# Altium project EL.T01.MSHM.PrjPcb
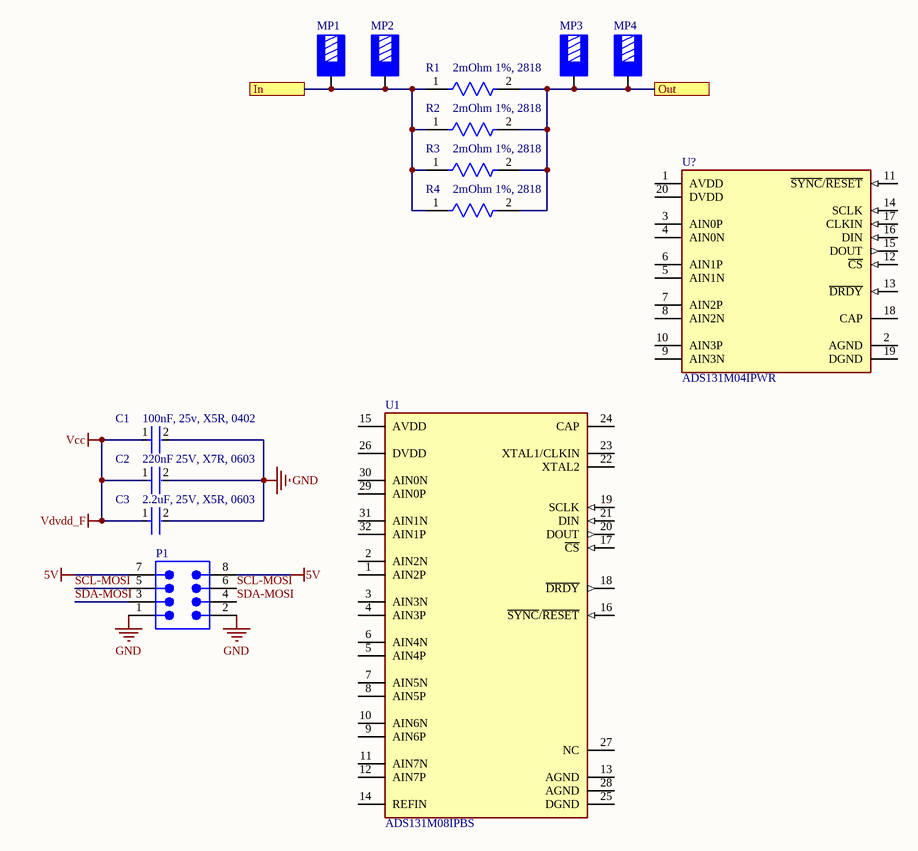
[diagram p0: MainShunt.SchDoc]
1 sheet, 14 parts. Net scope: flat (ports and power ports of the same name join across sheets).
Board file: MainShunt.PcbDoc

## Sheet MainShunt.SchDoc
size A4; SheetNumber: 1; SheetTotal: 1

### Parts
C1  100nF, 25v, X5R, 0402  [FP-GRM155-0_05-IPC_C]
C2  220nF 25V, X7R, 0603  [FP-GCM188-0_1-IPC_B]
C3  2.2uF, 25V, X5R, 0603  [FP-GRM188-0_1-e0_2_0_5-MFG]
MP1  7460307  [7460307_chemical surface]  (value not drawn)
MP2  7460307  [7460307_chemical surface]  (value not drawn)
MP3  7460307  [7460307_chemical surface]  (value not drawn)
MP4  7460307  [7460307_chemical surface]  (value not drawn)
P1  61200821621  [61200821621]  (value not drawn)
R1  2mOhm 1%, 2818  [FP-WSHP2818-MFG]
R2  2mOhm 1%, 2818  [FP-WSHP2818-MFG]
R3  2mOhm 1%, 2818  [FP-WSHP2818-MFG]
R4  2mOhm 1%, 2818  [FP-WSHP2818-MFG]
U1  ADS131M08IPBS  [FP-PBS0032A-IPC_C]
U?  ADS131M04IPWR  [FP-PW0020A-IPC_A]

### Ports
In, Out

### Nets
5V: P1.7 P1.8
GND: C1.2 C2.2 C3.2 P1.1 P1.2
Vcc: C1.1 C2.1 C3.1  [also labelled Vdvdd_F]
SCL-MOSI: P1.5 P1.6
SDA-MOSI: P1.3 P1.4
NetMP1_1: MP1.1 MP2.1 R1.1 R2.1 R3.1 R4.1 ; port In
NetMP3_1: MP3.1 MP4.1 R1.2 R2.2 R3.2 R4.2 ; port Out

Not connected (* = marked no-connect by the designer): U1 1(AIN2P) 2(AIN2N) 3(AIN3N) 4(AIN3P) 5(AIN4P) 6(AIN4N) 7(AIN5N) 8(AIN5P) 9(AIN6P) 10(AIN6N) 11(AIN7N) 12(AIN7P) 13(AGND) 14(REFIN) 15(AVDD) 16(~{SYNC}/~{RESET}) 17(~{CS}) 18(~{DRDY}) 19(SCLK) 20(DOUT) 21(DIN) 22(XTAL2) 23(XTAL1/CLKIN) 24(CAP) 25(DGND) 26(DVDD) 27(NC) 28(AGND) 29(AIN0P) 30(AIN0N) 31(AIN1N) 32(AIN1P); U? 1(AVDD) 2(AGND) 3(AIN0P) 4(AIN0N) 5(AIN1N) 6(AIN1P) 7(AIN2P) 8(AIN2N) 9(AIN3N) 10(AIN3P) 11(~{SYNC}/~{RESET}) 12(~{CS}) 13(~{DRDY}) 14(SCLK) 15(DOUT) 16(DIN) 17(CLKIN) 18(CAP) 19(DGND) 20(DVDD)

### Library data of the parts
C1 = CMP-06035-003661-1: Chip Multilayer Ceramic Capacitors for General Purpose, 0402, 0.10uF, X7R, 15%, 10%, 25V; Length: 1mm; Depth: 0.5mm; Dielectric: X7R; Voltage Rating: 25V; Lead Free: Lead Free; Case Code (Imperial): 0402; Voltage: 25V; Min Operating Temperature: -55°C; Tolerance: 10%; Dielectric Material: Ceramic; Voltage Rating (DC): 25V; Max Operating Temperature: 125°C; Capacitance: 100nF; Thickness: 0.022inch; Case/Package: 0402; Height: 0.5mm; Resistor Type: Ceramic; Weight: 0.000212oz; Case Code (Metric): 1005; Package Quantity: 10000; Termination: SMD/SMT; Width: 0.02inch; Mount: Surface Mount; Packaging: Tape and Reel
C2 = CMP-2006-02366-2: Ceramic Capacitor for Automotive 220nF  ±10% 25VDC X7R 0603 Paper T/R; Capacitance: 220nF; Mount: Surface Mount; Ratings: AEC-Q200; Case/Package: 0603; Packaging: Tape and Reel; Radiation Hardening: No; Voltage: 25V; Dielectric: X7R; Case Code (Imperial): 0603; Max Operating Temperature: 125°C; Min Operating Temperature: -55°C; Depth: 0.8mm; Termination: SMD/SMT; Package Quantity: 1; Case Code (Metric): 1608; Thickness: 0.035inch; Voltage Rating: 25V; Tolerance: 10%; Voltage Rating (DC): 25V; Height: 0.8mm; Lead Free: Lead Free; Length: 1.6mm; Width: 0.031inch
C3 = CMP-2006-02820-2: Chip Multilayer Ceramic Capacitors for General Purpose, 0603, 2.2uF, X5R, 15%, 10%, 25V; Number of Pins: 2; Dielectric: X5R; Tolerance: 10%; Case Code (Imperial): 0603; Thickness: 0.035inch; Case/Package: 0603; Lead Free: Lead Free; Mount: Surface Mount; Material: Ceramic; Depth: 0.8mm; Voltage: 25V; Capacitance: 2.2uF; Min Operating Temperature: -55°C; Package Quantity: 4000; REACH SVHC: No SVHC; Resistor Type: Ceramic; Packaging: Tape and Reel; Case Code (Metric): 1608; Max Operating Temperature: 85°C; Width: 0.8mm; Termination: SMD/SMT; Voltage Rating: 25V; Length: 1.6mm; Voltage Rating (DC): 25V; Height: 0.8mm; Radiation Hardening: No; Weight: 0.000222oz
MP1-MP4 = CMP-03913-18187384-1: 7460307 8 Pin Power Element, Copper Zinc Alloy, 160A, M4, Vertical; Number of Contacts: 8; Insulation: Non-Insulated; Width: 9mm; Min Operating Temperature: -55°C; Number of Pins: 8; Contact Material: Copper; RoHS: Compliant; Packaging: Bulk; Thread Size: M4; Termination: Press-Fit; Mount: Through Hole; Material: Brass; Height: 10.5mm; Length: 9mm; Max Operating Temperature: 150°C; Number of Rows: 2; Contact Plating: Tin; NexarPartId: 18187384; Current Rating: 160A; REACH SVHC: Unknown
P1 = CMP-1502-00006-2: NexarPartId: 32855460; Gender: Male; Row Spacing: 2.54mm; Connector Type: Male Pin; Insulation Resistance: 1GΩ; Contact Resistance: 20mΩ; Number of Positions: 8; Current Rating: 3A; Operating Supply Voltage: 250V; Orientation: Vertical; Lead Pitch: 2.54mm; Length: 17.82mm; Max Operating Temperature: 105°C; Mount: Through Hole; Color: Black; Insulation Material: PBT; RoHS: Compliant; Contact Material: Copper; Number of Contacts: 8; Pitch: 2.54mm; Contact Plating: Gold; Min Operating Temperature: -40°C; Number of Pins: 8; Termination: Solder; REACH SVHC: Unknown; Number of Rows: 2
R1-R4 = CMP-00030-78727543-1: WSHP28182L000FEB Res Metal Strip 2818 0.002 Ohm 1% 10W ±200ppm/C Pad SMD Automotive T/R; Temperature Coefficient: 200ppm/°C; Resistance: 2mΩ; Case/Package: 2818; Packaging: Cut Tape; NexarPartId: 78727543; Composition: Metal Element; Height: 3.43mm; Power Rating: 10W; Min Operating Temperature: -65°C; Schedule B: 8533210045, 8533210045; Max Operating Temperature: 170°C; Tolerance: 1%; RoHS: Non-Compliant
U1 = CMP-04860-000022-1: 8 CHANNEL 24 BIT SIMULTANEOUS SA
U? = CMP-04860-000051-1: IC ADC 24BIT SIGMA-DELTA 20TSSOP